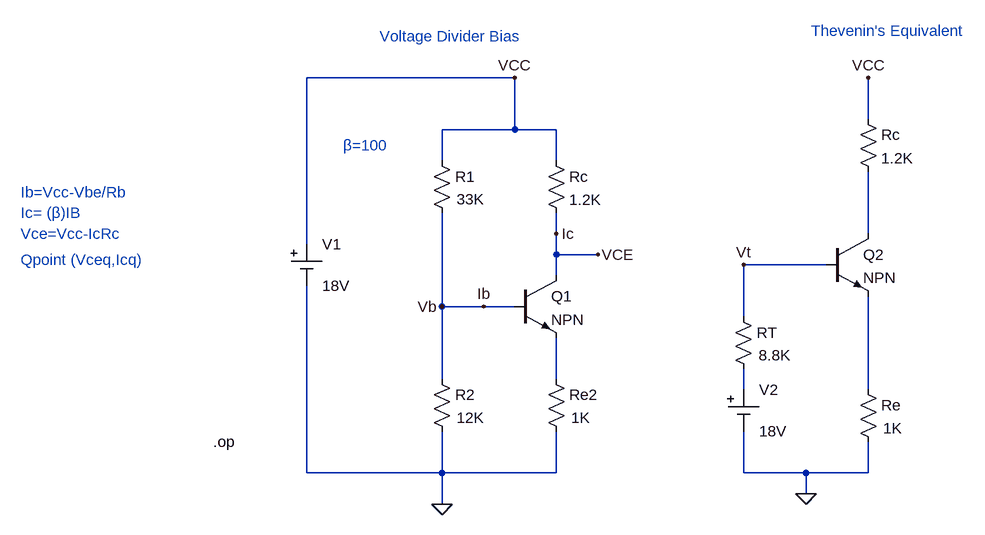
[diagram p0: schematic voltage_divider_bias.asc]
voltage_divider_bias.asc, the LTspice schematic file:
Version 4
SHEET 1 1152 680
WIRE 416 0 96 0
WIRE 960 64 960 0
WIRE 416 80 416 0
WIRE 416 80 304 80
WIRE 480 80 416 80
WIRE 304 128 304 80
WIRE 480 128 480 80
WIRE 480 240 480 208
WIRE 960 240 960 144
WIRE 96 256 96 0
WIRE 480 272 480 240
WIRE 544 272 480 272
WIRE 896 288 768 288
WIRE 480 304 480 272
WIRE 304 352 304 208
WIRE 368 352 304 352
WIRE 416 352 368 352
WIRE 768 368 768 288
WIRE 304 464 304 352
WIRE 480 464 480 400
WIRE 768 480 768 448
WIRE 960 480 960 336
WIRE 96 608 96 320
WIRE 304 608 304 544
WIRE 304 608 96 608
WIRE 480 608 480 544
WIRE 480 608 304 608
WIRE 768 608 768 544
WIRE 864 608 768 608
WIRE 960 608 960 560
WIRE 960 608 864 608
WIRE 864 640 864 608
WIRE 304 656 304 608
FLAG 304 656 0
FLAG 416 0 VCC
FLAG 544 272 VCE
FLAG 368 352 Ib
FLAG 480 240 Ic
FLAG 304 352 Vb
FLAG 960 0 VCC
FLAG 864 640 0
FLAG 768 288 Vt
SYMBOL npn 416 304 R0
SYMATTR InstName Q1
SYMBOL res 288 112 R0
WINDOW 3 39 75 Left 2
SYMATTR InstName R1
SYMATTR Value 33K
SYMBOL res 464 112 R0
SYMATTR InstName Rc
SYMATTR Value 1.2K
SYMBOL Misc/cell 96 256 R0
SYMATTR InstName V1
SYMATTR Value 18V
SYMBOL res 288 448 R0
WINDOW 3 39 75 Left 2
SYMATTR InstName R2
SYMATTR Value 12K
SYMBOL res 464 448 R0
WINDOW 3 39 75 Left 2
SYMATTR InstName Re2
SYMATTR Value 1K
SYMBOL npn 896 240 R0
SYMATTR InstName Q2
SYMBOL res 944 48 R0
SYMATTR InstName Rc
SYMATTR Value 1.2K
SYMBOL res 944 464 R0
WINDOW 3 39 75 Left 2
SYMATTR InstName Re
SYMATTR Value 1K
SYMBOL res 752 352 R0
WINDOW 3 39 75 Left 2
SYMATTR InstName RT
SYMATTR Value 8.8K
SYMBOL Misc/cell 768 480 R0
SYMATTR InstName V2
SYMATTR Value 18V
TEXT -48 560 Left 2 !.op
TEXT 208 -64 Left 2 ;Voltage Divider Bias
TEXT -344 176 Left 2 ;Ib=Vcc-Vbe/Rb
TEXT -344 208 Left 2 ;Ic= (β)IB
TEXT -344 240 Left 2 ;Vce=Vcc-IcRc
TEXT -344 280 Left 2 ;Qpoint (Vceq,Icq)
TEXT 152 104 Left 2 ;β=100
TEXT 872 -72 Left 2 ;Thevenin's Equivalent

The netlist it stands for:
* voltage_divider_bias.asc
Q1 Ic Vb N002 0 NPN
R1 VCC Vb 33K
Rc VCC Ic 1.2K
V1 VCC 0 18V
R2 Vb 0 12K
Re2 N002 0 1K
Q2 N001 Vt N004 0 NPN
Rc VCC N001 1.2K
Re N004 0 1K
RT Vt N003 8.8K
V2 N003 0 18V
.model NPN NPN
.model PNP PNP
.lib standard.bjt
.op
* Voltage Divider Bias
* Ib=Vcc-Vbe/Rb
* Ic= (β)IB
* Vce=Vcc-IcRc
* Qpoint (Vceq,Icq)
* β=100
* Thevenin's Equivalent
.backanno
.end